# EAGLE design WRT8749R4 (EAGLE 4.16)
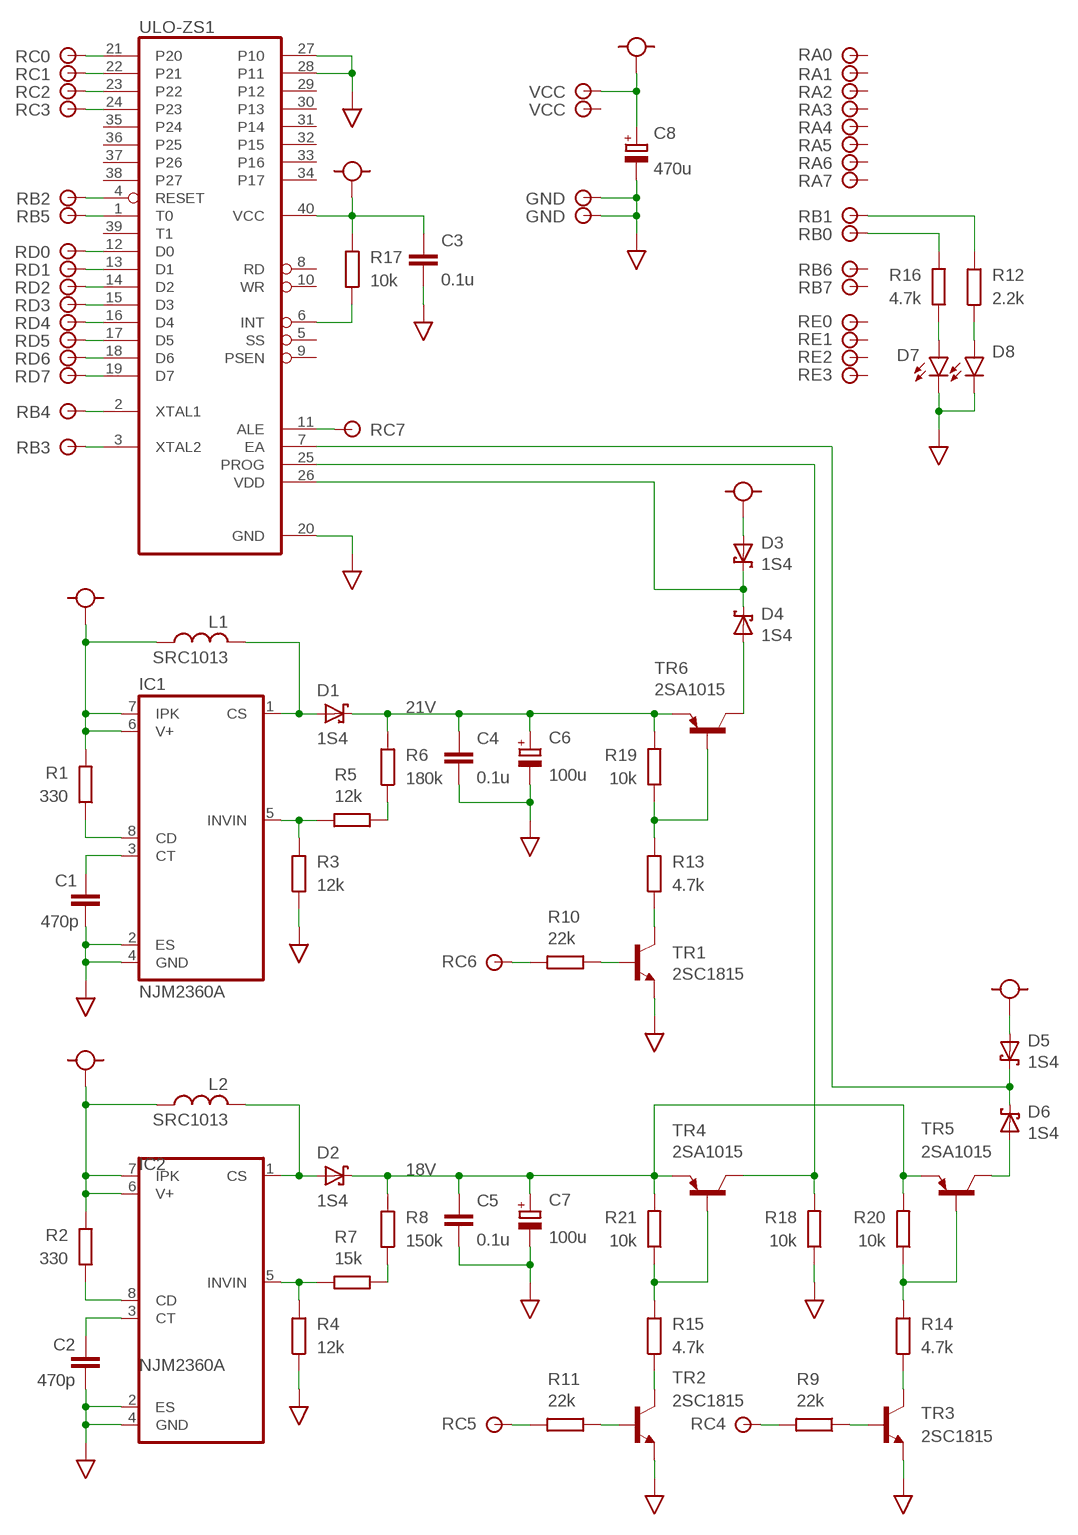
[diagram p0: schematic, sheet 1]

## Parts
C1  470p  C-CERAMIC  [C025-025X050]
C2  470p  C-CERAMIC  [C025-025X050]
C3  0.1u  C-CERAMIC  [C025-025X050]
C4  0.1u  C-CERAMIC  [C025-025X050]
C5  0.1u  C-CERAMIC  [C025-025X050]
C6  100u  C100U25V  [C100U25V]
C7  100u  C100U25V  [C100U25V]
C8  470u  C-CHEMICAL  [C-CHEMICAL]
D1  1S4  SVD  [SVD]
D2  1S4  SVD  [SVD]
D3  1S4  SVD  [SVD]
D4  1S4  SVD  [SVD]
D5  1S4  SVD  [SVD]
D6  1S4  SVD  [SVD]
D7  OSX5212411  [OSX5212411]
D8  OSX5212411  [OSX5212411]
IC1  NJM2360A  [DIL08]
IC2  NJM2360A  [DIL08]
L1  SRC1013  [SRC1013]
L2  SRC1013  [SRC1013]
R1  330  R1/8W  [0207/10]
R2  330  R1/8W  [0207/10]
R3  12k  R1/8W  [0207/10]
R4  12k  R1/8W  [0207/10]
R5  12k  R1/8W  [0207/10]
R6  180k  R1/8W  [0207/10]
R7  15k  R1/8W  [0207/10]
R8  150k  R1/8W  [0207/10]
R9  22k  R1/8W  [0207/10]
R10  22k  R1/8W  [0207/10]
R11  22k  R1/8W  [0207/10]
R12  2.2k  R1/8W  [0207/10]
R13  4.7k  R1/8W  [0207/10]
R14  4.7k  R1/8W  [0207/10]
R15  4.7k  R1/8W  [0207/10]
R16  4.7k  R1/8W  [0207/10]
R17  10k  R1/8W  [0207/10]
R18  10k  R1/8W  [0207/10]
R19  10k  R1/8W  [0207/10]
R20  10k  R1/8W  [0207/10]
R21  10k  R1/8W  [0207/10]
TR1  2SC1815  TR-NPN  [TO92-BCE]
TR2  2SC1815  TR-NPN  [TO92-BCE]
TR3  2SC1815  TR-NPN  [TO92-BCE]
TR4  2SA1015  TR-PNP  [TO92-BCE]
TR5  2SA1015  TR-PNP  [TO92-BCE]
TR6  2SA1015  TR-PNP  [TO92-BCE]
U$1  RC0  LAND-NN-N  [LAND-NN-N]
U$2  RC1  LAND-NN-N  [LAND-NN-N]
U$3  RC2  LAND-NN-N  [LAND-NN-N]
U$4  RC3  LAND-NN-N  [LAND-NN-N]
U$5  RB2  LAND-NN-N  [LAND-NN-N]
U$6  RB5  LAND-NN-N  [LAND-NN-N]
U$7  RD0  LAND-NN-N  [LAND-NN-N]
U$8  RD1  LAND-NN-N  [LAND-NN-N]
U$9  RD2  LAND-NN-N  [LAND-NN-N]
U$10  RD3  LAND-NN-N  [LAND-NN-N]
U$11  RD4  LAND-NN-N  [LAND-NN-N]
U$12  RD5  LAND-NN-N  [LAND-NN-N]
U$13  RD6  LAND-NN-N  [LAND-NN-N]
U$14  RD7  LAND-NN-N  [LAND-NN-N]
U$15  RB4  LAND-NN-N  [LAND-NN-N]
U$16  RB3  LAND-NN-N  [LAND-NN-N]
U$17  RC7  LAND-NN-N  [LAND-NN-N]
U$18  RC6  LAND-NN-N  [LAND-NN-N]
U$19  RC5  LAND-NN-N  [LAND-NN-N]
U$20  VCC  LAND-NN-N  [LAND-NN-N]
U$21  GND  LAND-NN-N  [LAND-NN-N]
U$22  GND  LAND-NN-N  [LAND-NN-N]
U$24  RB1  LAND-NN-N  [LAND-NN-N]
U$25  RB0  LAND-NN-N  [LAND-NN-N]
U$26  RC4  LAND-NN-N  [LAND-NN-N]
U$27  RA0  LAND-NN-N  [LAND-NN-N]
U$28  RA1  LAND-NN-N  [LAND-NN-N]
U$29  RA2  LAND-NN-N  [LAND-NN-N]
U$30  RA3  LAND-NN-N  [LAND-NN-N]
U$31  RA4  LAND-NN-N  [LAND-NN-N]
U$32  RA5  LAND-NN-N  [LAND-NN-N]
U$33  RA6  LAND-NN-N  [LAND-NN-N]
U$34  RA7  LAND-NN-N  [LAND-NN-N]
U$35  RB6  LAND-NN-N  [LAND-NN-N]
U$36  RB7  LAND-NN-N  [LAND-NN-N]
U$37  RE0  LAND-NN-N  [LAND-NN-N]
U$38  RE1  LAND-NN-N  [LAND-NN-N]
U$39  RE2  LAND-NN-N  [LAND-NN-N]
U$40  RE3  LAND-NN-N  [LAND-NN-N]
U$41  VCC  LAND-NN-N  [LAND-NN-N]
ULO-ZS1  8749ZIF  [8749ZIF]

## Nets
18V: C5.1 C7.+ D2.C R8.2 R20.2 R21.2 TR4.E TR5.E
21V: C4.1 C6.+ D1.C R6.2 R19.2 TR6.E
A8: U$7.P ULO-ZS1.12(D0)
A9: U$8.P ULO-ZS1.13(D1)
A10: U$9.P ULO-ZS1.14(D2)
A11: U$10.P ULO-ZS1.15(D3)
A12: U$11.P ULO-ZS1.16(D4)
A13: U$12.P ULO-ZS1.17(D5)
A14: U$13.P ULO-ZS1.18(D6)
A15: U$14.P ULO-ZS1.19(D7)
EA: D5.C D6.C ULO-ZS1.7(EA)
EASW: R9.2 U$26.P
GND: C1.2 C2.2 C3.2 C4.2 C5.2 C6.- C7.- C8.- D7.K(C) D8.K(C) IC1.2(ES) IC1.4(GND) IC2.2(ES) IC2.4(GND) R3.1 R4.1 R18.1 TR1.E TR2.E TR3.E U$21.P U$22.P ULO-ZS1.20(GND) ULO-ZS1.27(P10) ULO-ZS1.28(P11)
N$2: U$17.P ULO-ZS1.11(ALE)
N$3: R17.1 ULO-ZS1.6(INT)
N$4: IC2.8(CD) R2.1
N$5: D2.A IC2.1(CS) L2.2
N$6: R15.1 TR2.C
N$7: R15.2 R21.1 TR4.B
N$8: C2.1 IC2.3(CT)
N$9: R11.1 TR2.B
N$10: U$1.P ULO-ZS1.21(P20)
N$11: U$2.P ULO-ZS1.22(P21)
N$12: U$5.P ULO-ZS1.4(RESET)
N$13: U$6.P ULO-ZS1.1(T0)
N$14: U$3.P ULO-ZS1.23(P22)
N$15: U$4.P ULO-ZS1.24(P23)
N$16: R10.2 U$18.P
N$17: U$15.P ULO-ZS1.2(XTAL1)
N$18: U$16.P ULO-ZS1.3(XTAL2)
N$19: IC2.5(INVIN) R4.2 R7.2
N$20: R7.1 R8.1
N$21: D7.A R16.1
N$22: D8.A R12.1
N$23: R16.2 U$25.P
N$24: R12.2 U$24.P
N$39: R13.1 TR1.C
N$40: R13.2 R19.1 TR6.B
N$41: D4.A TR6.C
N$42: IC1.8(CD) R1.1
N$43: D1.A IC1.1(CS) L1.2
N$44: C1.1 IC1.3(CT)
N$46: IC1.5(INVIN) R3.2 R5.2
N$47: R5.1 R6.1
N$48: R10.1 TR1.B
N$49: R14.1 TR3.C
N$50: R14.2 R20.1 TR5.B
N$52: R9.1 TR3.B
N$53: D6.A TR5.C
PROG: R18.2 TR4.C ULO-ZS1.25(PROG)
PROGSW: R11.2 U$19.P
VCC: C3.1 C8.+ D3.A D5.A IC1.6(V+) IC1.7(IPK) IC2.6(V+) IC2.7(IPK) L1.1 L2.1 R1.2 R2.2 R17.2 U$20.P ULO-ZS1.40(VCC)
VDD: D3.C D4.C ULO-ZS1.26(VDD)
Unconnected: U$27.P U$28.P U$29.P U$30.P U$31.P U$32.P U$33.P U$34.P U$35.P U$36.P U$37.P U$38.P U$39.P U$40.P U$41.P ULO-ZS1.5(SS) ULO-ZS1.8(RD) ULO-ZS1.9(PSEN) ULO-ZS1.10(WR) ULO-ZS1.29(P12) ULO-ZS1.30(P13) ULO-ZS1.31(P14) ULO-ZS1.32(P15) ULO-ZS1.33(P16) ULO-ZS1.34(P17) ULO-ZS1.35(P24) ULO-ZS1.36(P25) ULO-ZS1.37(P26) ULO-ZS1.38(P27) ULO-ZS1.39(T1)

## Library data of the parts
C1-C5 = olimex-devices:C-CERAMIC: Ceramic Conenser
C6 C7 = olimex-devices:C100U25V
C8 = olimex-devices:C-CHEMICAL
D1-D6 = olimex-devices:SVD
D7 D8 = olimex-devices:OSX5212411
IC1 IC2 = olimex-devices:NJM2360A
L1 L2 = olimex-devices:SRC1013
R1-R21 = olimex-devices:R1/8W: Carbon Resistor
TR1-TR3 = olimex-devices:TR-NPN: Transistor for Small Signal
TR4-TR6 = olimex-devices:TR-PNP: Transistor for Small Signal
U$1-U$22 U$24-U$41 = olimex-devices:LAND-NN-N
ULO-ZS1 = olimex-devices:8749ZIF

## Net classes
2 Vcc: width 0.508 mm

## Board
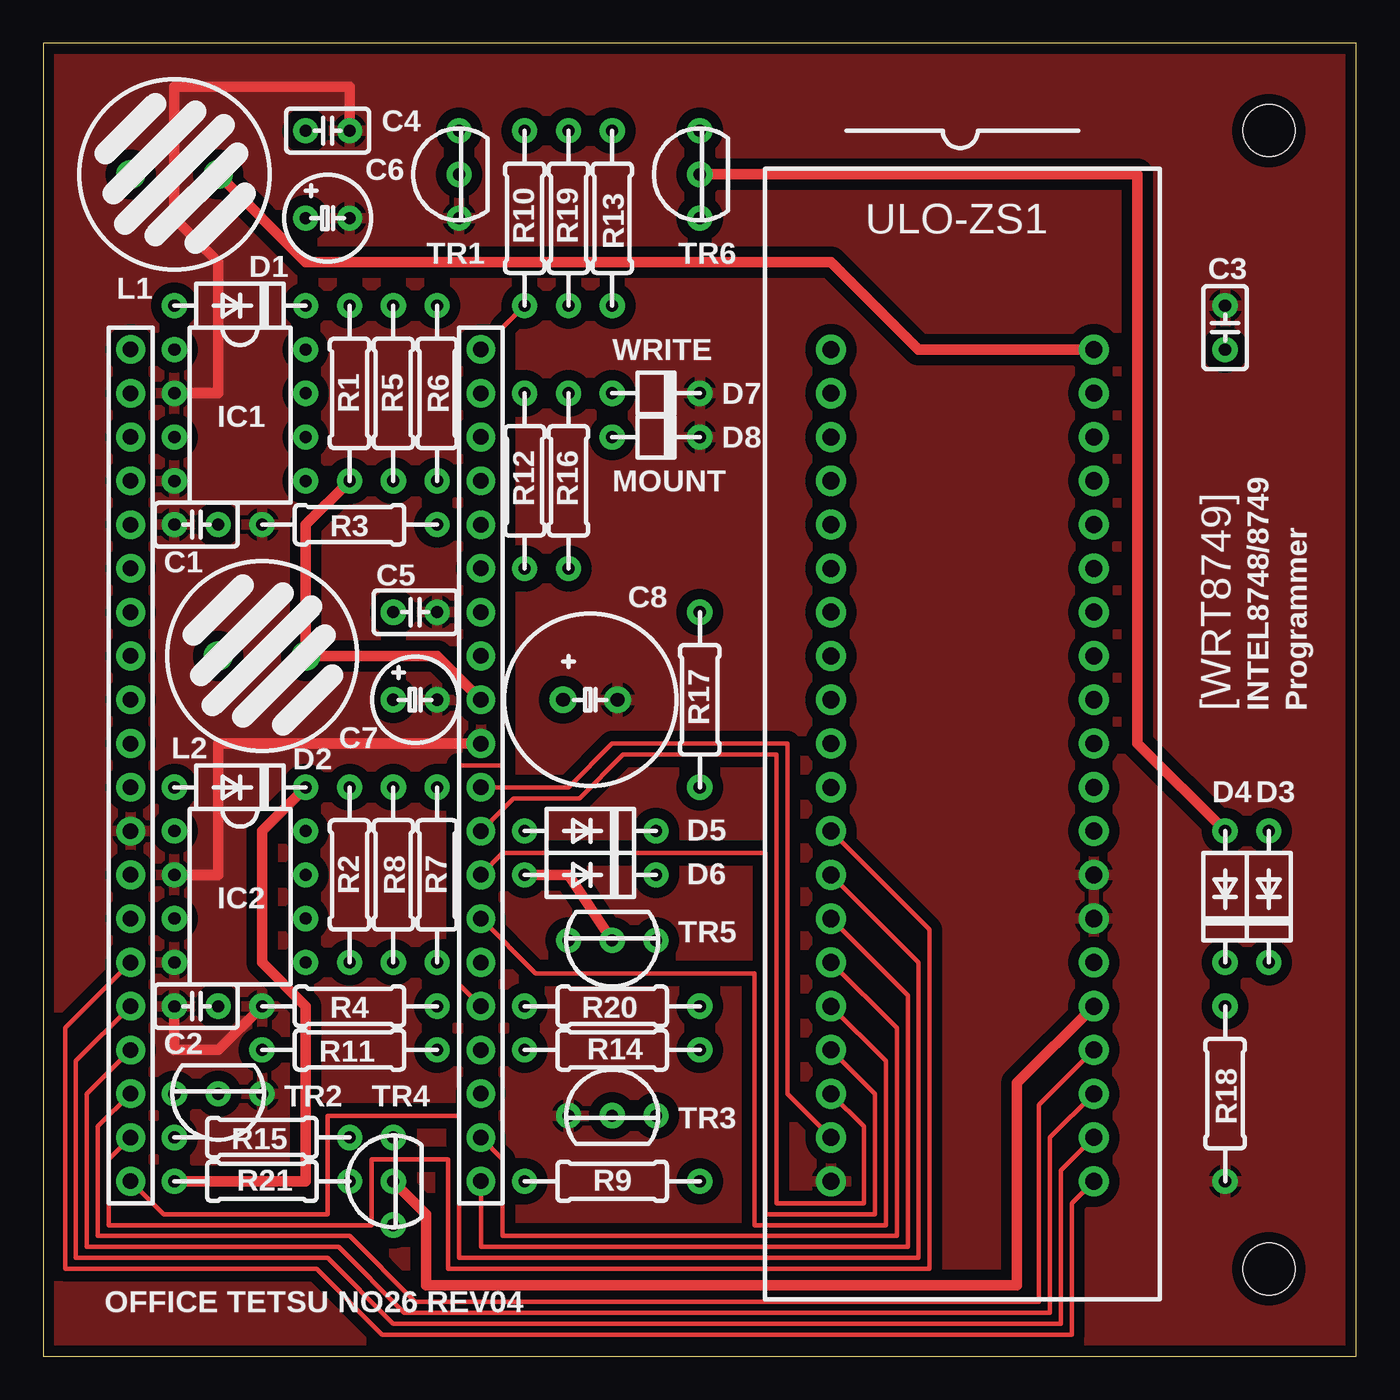
[diagram p1: board, top side]
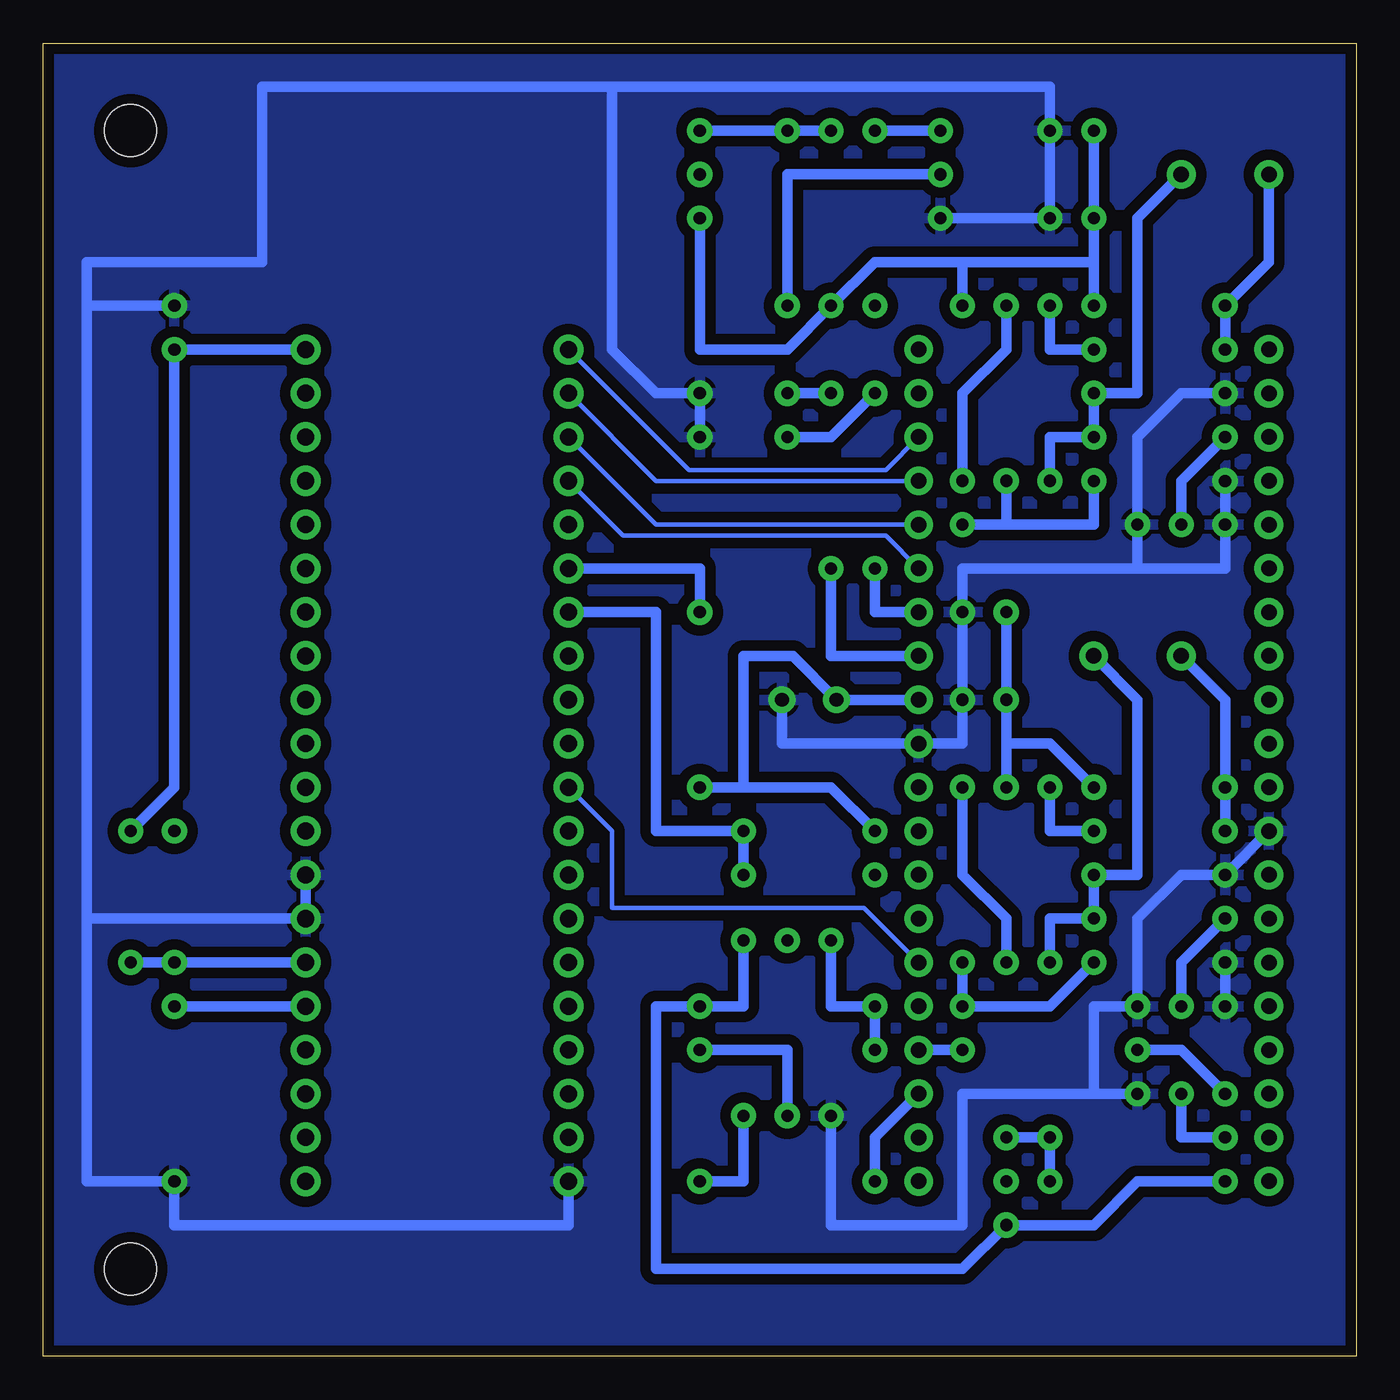
[diagram p2: board, bottom side, seen from below]

Size 76.2 x 76.2 mm. Coordinates in mm from the lower left corner, seen from the top.
Outline: 0,0 76.2,0 76.2,76.2 0,76.2 0,0
Copper layers (1*16): Top 0.035mm / dielectric 1.5mm / Bottom 0.035mm
Design rules "OfficeTETSUstandard": minimum track width 6mil, minimum drill 12mil, track to track 6mil, track to pad 6mil, pad to pad 6mil, via to via 6mil, smd to smd 0mil, copper to edge 10mil, drill to drill 10mil, minimum pad ring 15mil, minimum via ring 6mil, stop-mask expansion 2mil, vias tented up to drill 25mil, thermal gap 10mil
Holes 3 mm at 71.12,5.08 71.12,71.12

### Footprints (pad centres in the part's own frame; a part is rotated, then mirrored left to right if it is on the bottom)
C025-025X050 = drill 0.7 round: 1 -1.27,0; 2 1.27,0
C100U25V = drill 0.7 round: + -1.27,0; - 1.27,0
C-CHEMICAL = drill 0.8 round: + -1.587,0; - 1.587,0
SVD = drill 0.7 round: A 3.81,0; C -3.81,0
OSX5212411 = drill 0.7 round: A -2.54,0; K 2.54,0
DIL08 = drill 0.7 round: 1 -3.81,-3.81; 2 -1.27,-3.81; 3 1.27,-3.81; 4 3.81,-3.81; 5 3.81,3.81; 6 1.27,3.81; 7 -1.27,3.81; 8 -3.81,3.81
SRC1013 = drill 0.9 round: 1 0,2.54; 2 0,-2.54
0207/10 = drill 0.7 round: 1 -5.08,0; 2 5.08,0
TO92-BCE = drill 0.7 round: B 2.54,0; C 0,0; E -2.54,0
LAND-NN-N = drill 0.9 round: P 0,0
8749ZIF = drill 0.991 round: 1 -24.13,-7.62; 2 -21.59,-7.62; 3 -19.05,-7.62; 4 -16.51,-7.62; 5 -13.97,-7.62; 6 -11.43,-7.62; 7 -8.89,-7.62; 8 -6.35,-7.62; 9 -3.81,-7.62; 10 -1.27,-7.62; 11 1.27,-7.62; 12 3.81,-7.62; 13 6.35,-7.62; 14 8.89,-7.62; 15 11.43,-7.62; 16 13.97,-7.62; 17 16.51,-7.62; 18 19.05,-7.62; 19 21.59,-7.62; 20 24.13,-7.62; 21 24.13,7.62; 22 21.59,7.62; 23 19.05,7.62; 24 16.51,7.62; 25 13.97,7.62; 26 11.43,7.62; 27 8.89,7.62; 28 6.35,7.62; 29 3.81,7.62; 30 1.27,7.62; 31 -1.27,7.62; 32 -3.81,7.62; 33 -6.35,7.62; 34 -8.89,7.62; 35 -11.43,7.62; 36 -13.97,7.62; 37 -16.51,7.62; 38 -19.05,7.62; 39 -21.59,7.62; 40 -24.13,7.62

### Placement (x,y rotation side)
C1  8.89,48.26 180 top
C2  8.89,20.32 180 top
C3  68.58,59.69 90 top
C4  16.51,71.12 0 top
C5  21.59,43.18 0 top
C6  16.51,66.04 0 top
C7  21.59,38.1 0 top
C8  31.75,38.1 0 top
D1  11.43,60.96 180 top
D2  11.43,33.02 180 top
D3  71.12,26.67 90 top
D4  68.58,26.67 90 top
D5  31.75,30.48 180 top
D6  31.75,27.94 180 top
D7  35.56,55.88 0 top
D8  35.56,53.34 0 top
IC1  11.43,54.61 270 top
IC2  11.43,26.67 270 top
L1  7.62,68.58 270 top
L2  12.7,40.64 270 top
R1  17.78,55.88 270 top
R2  17.78,27.94 270 top
R3  17.78,48.26 0 top
R4  17.78,20.32 0 top
R5  20.32,55.88 270 top
R6  22.86,55.88 90 top
R7  22.86,27.94 270 top
R8  20.32,27.94 90 top
R9  33.02,10.16 180 top
R10  27.94,66.04 270 top
R11  17.78,17.78 0 top
R12  27.94,50.8 270 top
R13  33.02,66.04 90 top
R14  33.02,17.78 180 top
R15  12.7,12.7 0 top
R16  30.48,50.8 270 top
R17  38.1,38.1 270 top
R18  68.58,15.24 90 top
R19  30.48,66.04 270 top
R20  33.02,20.32 0 top
R21  12.7,10.16 180 top
TR1  24.13,68.58 90 top
TR2  10.16,15.24 180 top
TR3  33.02,13.97 0 top
TR4  20.32,10.16 90 top
TR5  33.02,24.13 180 top
TR6  38.1,68.58 90 top
U$1  5.08,22.86 180 top
U$2  5.08,20.32 180 top
U$3  5.08,17.78 180 top
U$4  5.08,15.24 180 top
U$5  25.4,45.72 0 top
U$6  25.4,53.34 0 top
U$7  5.08,12.7 180 top
U$8  5.08,10.16 180 top
U$9  25.4,10.16 0 top
U$10  25.4,12.7 0 top
U$11  25.4,25.4 0 top
U$12  25.4,27.94 0 top
U$13  25.4,30.48 0 top
U$14  25.4,33.02 0 top
U$15  25.4,50.8 0 top
U$16  25.4,48.26 0 top
U$17  25.4,22.86 0 top
U$18  25.4,20.32 0 top
U$19  25.4,17.78 0 top
U$20  25.4,38.1 0 top
U$21  5.08,30.48 180 top
U$22  25.4,35.56 0 top
U$24  25.4,43.18 0 top
U$25  25.4,40.64 0 top
U$26  25.4,15.24 0 top
U$27  5.08,55.88 180 top
U$28  5.08,53.34 180 top
U$29  5.08,50.8 180 top
U$30  5.08,48.26 180 top
U$31  5.08,45.72 180 top
U$32  5.08,43.18 180 top
U$33  5.08,25.4 180 top
U$34  5.08,27.94 180 top
U$35  25.4,55.88 0 top
U$36  25.4,58.42 0 top
U$37  5.08,40.64 180 top
U$38  5.08,38.1 180 top
U$39  5.08,35.56 180 top
U$40  5.08,58.42 180 top
U$41  5.08,33.02 180 top
ULO-ZS1  53.34,34.29 270 top

### Tracks (layer width: path | path; a pad name or v marks a point on that pad's centre or on a via)
18V
  Top 0.61: D2.C 12.7,30.48 12.7,22.86 15.24,20.32 15.24,10.16 R21.2
  Bottom 0.61: D2.C 17.78,35.56 20.32,35.56 | 20.32,35.56 C7.+ C5.1 | 20.32,35.56 R8.2 | R21.2 12.7,10.16 15.24,7.62 TR4.E 22.86,5.08 40.64,5.08 40.64,20.32 R20.2 35.56,20.32 TR5.E
21V
  Bottom 0.61: C4.1 C6.+ 15.24,63.5 | D1.C 15.24,63.5 | 22.86,63.5 R6.2 | 15.24,63.5 22.86,63.5 | TR6.E 38.1,58.42 33.02,58.42 R19.2 27.94,63.5 22.86,63.5
A8
  Top 0.254: U$7.P 3.81,11.43 3.81,7.62 19.05,7.62 19.05,11.43 23.5,11.43 23.5,5.08 51.44,5.08 51.44,24.77 ULO-ZS1.12
A9
  Top 0.254: U$8.P 6.99,8.26 16.51,8.26 16.51,13.97 24.13,13.97 24.13,5.71 50.8,5.71 50.8,22.86 ULO-ZS1.13
A10
  Top 0.254: U$9.P 25.4,6.35 50.16,6.35 50.16,20.95 ULO-ZS1.14
A11
  Top 0.254: U$10.P 26.67,11.43 26.67,6.99 49.53,6.99 49.53,19.05 ULO-ZS1.15
A12
  Top 0.254: U$11.P 28.57,22.23 41.27,22.23 41.27,7.62 48.9,7.62 48.9,17.14 ULO-ZS1.16
A13
  Top 0.254: U$12.P 26.67,29.21 41.91,29.21 41.91,8.26 48.26,8.26 48.26,15.24 ULO-ZS1.17
A14
  Top 0.254: U$13.P 27.3,32.38 31.11,32.38 33.66,34.92 42.55,34.92 42.55,8.89 47.62,8.89 47.62,13.34 ULO-ZS1.18
A15
  Top 0.254: U$14.P 30.48,33.02 33.02,35.56 43.18,35.56 43.18,15.24 ULO-ZS1.19
EA
  Bottom 0.61: D6.C D5.C 40.64,30.48 40.64,43.18 ULO-ZS1.7
EASW
  Bottom 0.61: U$26.P 27.94,12.7 R9.2
GND
  Top 0.61: C2.2 7.62,17.78 10.16,17.78 R4.1 | C4.2 17.78,73.66 7.62,73.66 7.62,66.04 10.16,63.5 10.16,55.88 IC1.2 | U$22.P 10.16,35.56 10.16,27.94 IC2.2
  Bottom 0.61: C2.2 IC2.4 | U$21.P IC2.2 10.16,27.94 12.7,25.4 R4.1 15.24,20.32 15.24,15.24 | C8.- 33.34,35.56 U$22.P 22.86,35.56 C7.- C5.2 22.86,45.72 12.7,45.72 | ULO-ZS1.20 45.72,7.62 68.58,7.62 R18.1 73.66,10.16 73.66,25.4 | 73.66,60.96 73.66,25.4 | 73.66,60.96 C3.2 | ULO-ZS1.27 ULO-ZS1.28 ULO-ZS1.27 | IC1.2 10.16,55.88 12.7,53.34 R3.1 12.7,45.72 | IC1.4 C1.2 7.62,45.72 12.7,45.72 | 43.18,73.66 17.78,73.66 C4.2 C6.- TR1.E | 43.18,73.66 63.5,73.66 63.5,63.5 73.66,63.5 73.66,60.96 | 15.24,15.24 22.86,15.24 22.86,7.62 30.48,7.62 TR3.E | 73.66,25.4 ULO-ZS1.27 | D8.K D7.K 40.64,55.88 43.18,58.42 43.18,73.66 | 15.24,15.24 TR2.E
  pour Bottom (isolate 0.61): 0,76.2 76.2,76.2 76.2,0 0,0
  pour Top (isolate 0.61): 0,76.2 76.2,76.2 76.2,0 0,0
N$2
  Bottom 0.254: U$17.P 28.57,26.04 43.18,26.04 43.18,30.48 ULO-ZS1.11
N$3
  Bottom 0.61: ULO-ZS1.6 38.1,45.72 R17.1
N$4
  Bottom 0.61: IC2.8 17.78,30.48 R2.1
N$5
  Bottom 0.61: IC2.1 D2.A 7.62,38.1 L2.2
N$6
  Bottom 0.61: R15.1 10.16,12.7 TR2.C
N$7
  Bottom 0.61: R21.1 R15.2 TR4.B
N$8
  Bottom 0.61: IC2.3 10.16,22.86 C2.1
N$9
  Bottom 0.61: R11.1 10.16,17.78 TR2.B
N$10
  Top 0.254: U$1.P 1.27,19.05 1.27,5.08 15.88,5.08 19.68,1.27 59.69,1.27 59.69,8.89 ULO-ZS1.21
N$11
  Top 0.254: U$2.P 1.91,17.14 1.91,5.71 16.51,5.71 20.32,1.91 59.05,1.91 59.05,10.79 ULO-ZS1.22
N$12
  Bottom 0.254: U$5.P 27.3,47.62 42.55,47.62 ULO-ZS1.4
N$13
  Bottom 0.254: U$6.P 27.3,51.44 38.73,51.44 ULO-ZS1.1
N$14
  Top 0.254: U$3.P 2.54,15.24 2.54,6.35 17.14,6.35 20.95,2.54 58.42,2.54 58.42,12.7 ULO-ZS1.23
N$15
  Top 0.254: U$4.P 3.17,13.34 3.17,6.99 17.78,6.99 21.59,3.17 57.78,3.17 57.78,14.61 ULO-ZS1.24
N$16
  Top 0.254: U$18.P 24.13,21.59 24.13,34.29 26.67,34.29 26.67,59.69 R10.2
N$17
  Bottom 0.254: U$15.P 40.64,50.8 ULO-ZS1.2
N$18
  Bottom 0.254: U$16.P 40.64,48.26 ULO-ZS1.3
N$19
  Bottom 0.61: IC2.5 17.78,20.32 R4.2 R7.2
N$20
  Bottom 0.61: R8.1 20.32,25.4 22.86,27.94 R7.1
N$21
  Bottom 0.61: R16.1 D7.A
N$22
  Bottom 0.61: D8.A 30.48,53.34 R12.1
N$23
  Bottom 0.61: U$25.P 30.48,40.64 R16.2
N$24
  Bottom 0.61: U$24.P 27.94,43.18 R12.2
N$39
  Bottom 0.61: R13.1 33.02,68.58 TR1.C
N$40
  Bottom 0.61: R19.1 R13.2 TR6.B
N$41
  Top 0.61: D4.A 63.5,35.56 63.5,68.58 TR6.C
N$42
  Bottom 0.61: IC1.8 17.78,58.42 R1.1
N$43
  Bottom 0.61: L1.2 5.08,63.5 D1.A IC1.1
N$44
  Bottom 0.61: IC1.3 10.16,50.8 C1.1
N$46
  Bottom 0.61: IC1.5 15.24,48.26 20.32,48.26 | 20.32,48.26 R3.2 | 20.32,48.26 R5.2
N$47
  Bottom 0.61: R6.1 22.86,55.88 20.32,58.42 R5.1
N$48
  Bottom 0.61: TR1.B R10.1
N$49
  Bottom 0.61: R14.1 33.02,17.78 TR3.C
N$50
  Bottom 0.61: R14.2 R20.1 30.48,20.32 TR5.B
N$52
  Bottom 0.61: R9.1 35.56,10.16 TR3.B
N$53
  Top 0.61: D6.A 30.48,27.94 TR5.C
PROG
  Top 0.61: ULO-ZS1.25 56.52,15.88 56.52,4.13 22.23,4.13 22.23,8.26 TR4.C
  Bottom 0.61: ULO-ZS1.25 R18.2
PROGSW
  Bottom 0.61: R11.2 U$19.P
VCC
  Top 0.61: U$20.P 22.86,40.64 L2.1 15.24,48.26 R1.2 | L1.1 15.24,63.5 45.72,63.5 50.8,58.42 ULO-ZS1.40
  Bottom 0.61: L2.1 12.7,38.1 12.7,27.94 IC2.7 IC2.6 17.78,25.4 R2.2 | U$20.P C8.+ 32.7,40.64 35.56,40.64 35.56,33.02 | 35.56,33.02 30.48,33.02 D5.A | ULO-ZS1.40 C3.1 68.58,33.02 D3.A | L1.1 12.7,66.04 12.7,55.88 IC1.7 IC1.6 17.78,53.34 R1.2 | 35.56,33.02 R17.2
VDD
  Bottom 0.61: D4.C D3.C ULO-ZS1.26

### Text on the board
tPlace: WRITE | MOUNT | [WRT8749] | INTEL8748/8749 | Programmer | OFFICE TETSU NO26 REV04